# Altium project PCB_Project.PrjPcb
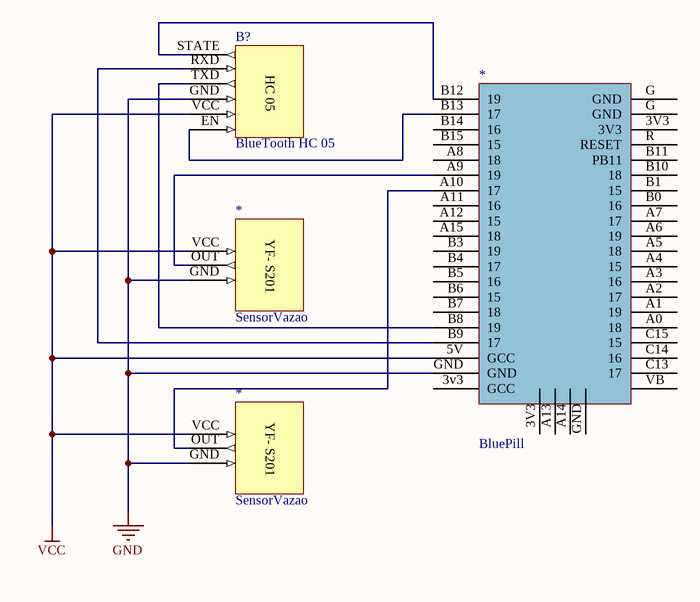
[diagram p0: Sheet1.SchDoc]
1 sheet, 4 parts. Net scope: global (net labels, ports and power ports of the same name join across sheets).
Board file: PCB1.PcbDoc

## Sheet Sheet1.SchDoc
size A4

### Parts
(Parts that share a designator on the sheet are numbered #1, #2 ... from top to bottom, then left to right.)
*#1  BluePill
*#2  SensorVazao
*#3  SensorVazao
B?  BlueTooth HC 05

### Nets
GND: *#1.GND *#2.GND *#3.GND B?.GND
VCC: *#1.5V(GCC) *#2.VCC *#3.VCC B?.VCC
Net*#1_A9: *#1.A9(19) *#2.OUT
Net*#1_A10: *#1.A10(17) *#3.OUT(PWM)
Net*#1_B8: *#1.B8(19) B?.TXD
Net*#1_B9: *#1.B9(17) B?.RXD
Net*#1_B12: *#1.B12(19) B?.STATE
Net*#1_B13: *#1.B13(17) B?.EN

Not connected (* = marked no-connect by the designer): *#1 3v3(GCC) 3V3 A0(18) A1(19) A2(17) A3(16) A4(15) A5(18) A6(19) A7(17) A8(18) A11(16) A12(15) A13(VB) A14(VB) A15(18) B0(16) B1(15) B3(19) B4(17) B5(16) B6(15) B7(18) B10(18) B11(PB11) B14(16) B15(15) C13(17) C14(16) C15(15) G(GND) R(RESET) VB(VBAT)

### Notes on the sheet
- (in symbol BlueTooth) HC 05
- (in symbol SensorVazao) YF- S201

### Library data of the parts
B? = BlueTooth